# EasyEDA schematic NAKUJA REMIX.json
TITLE: Sheet_1; REV: 1.0; Date: 2022-04-21; Sheet: 1/1; Company: Your Company
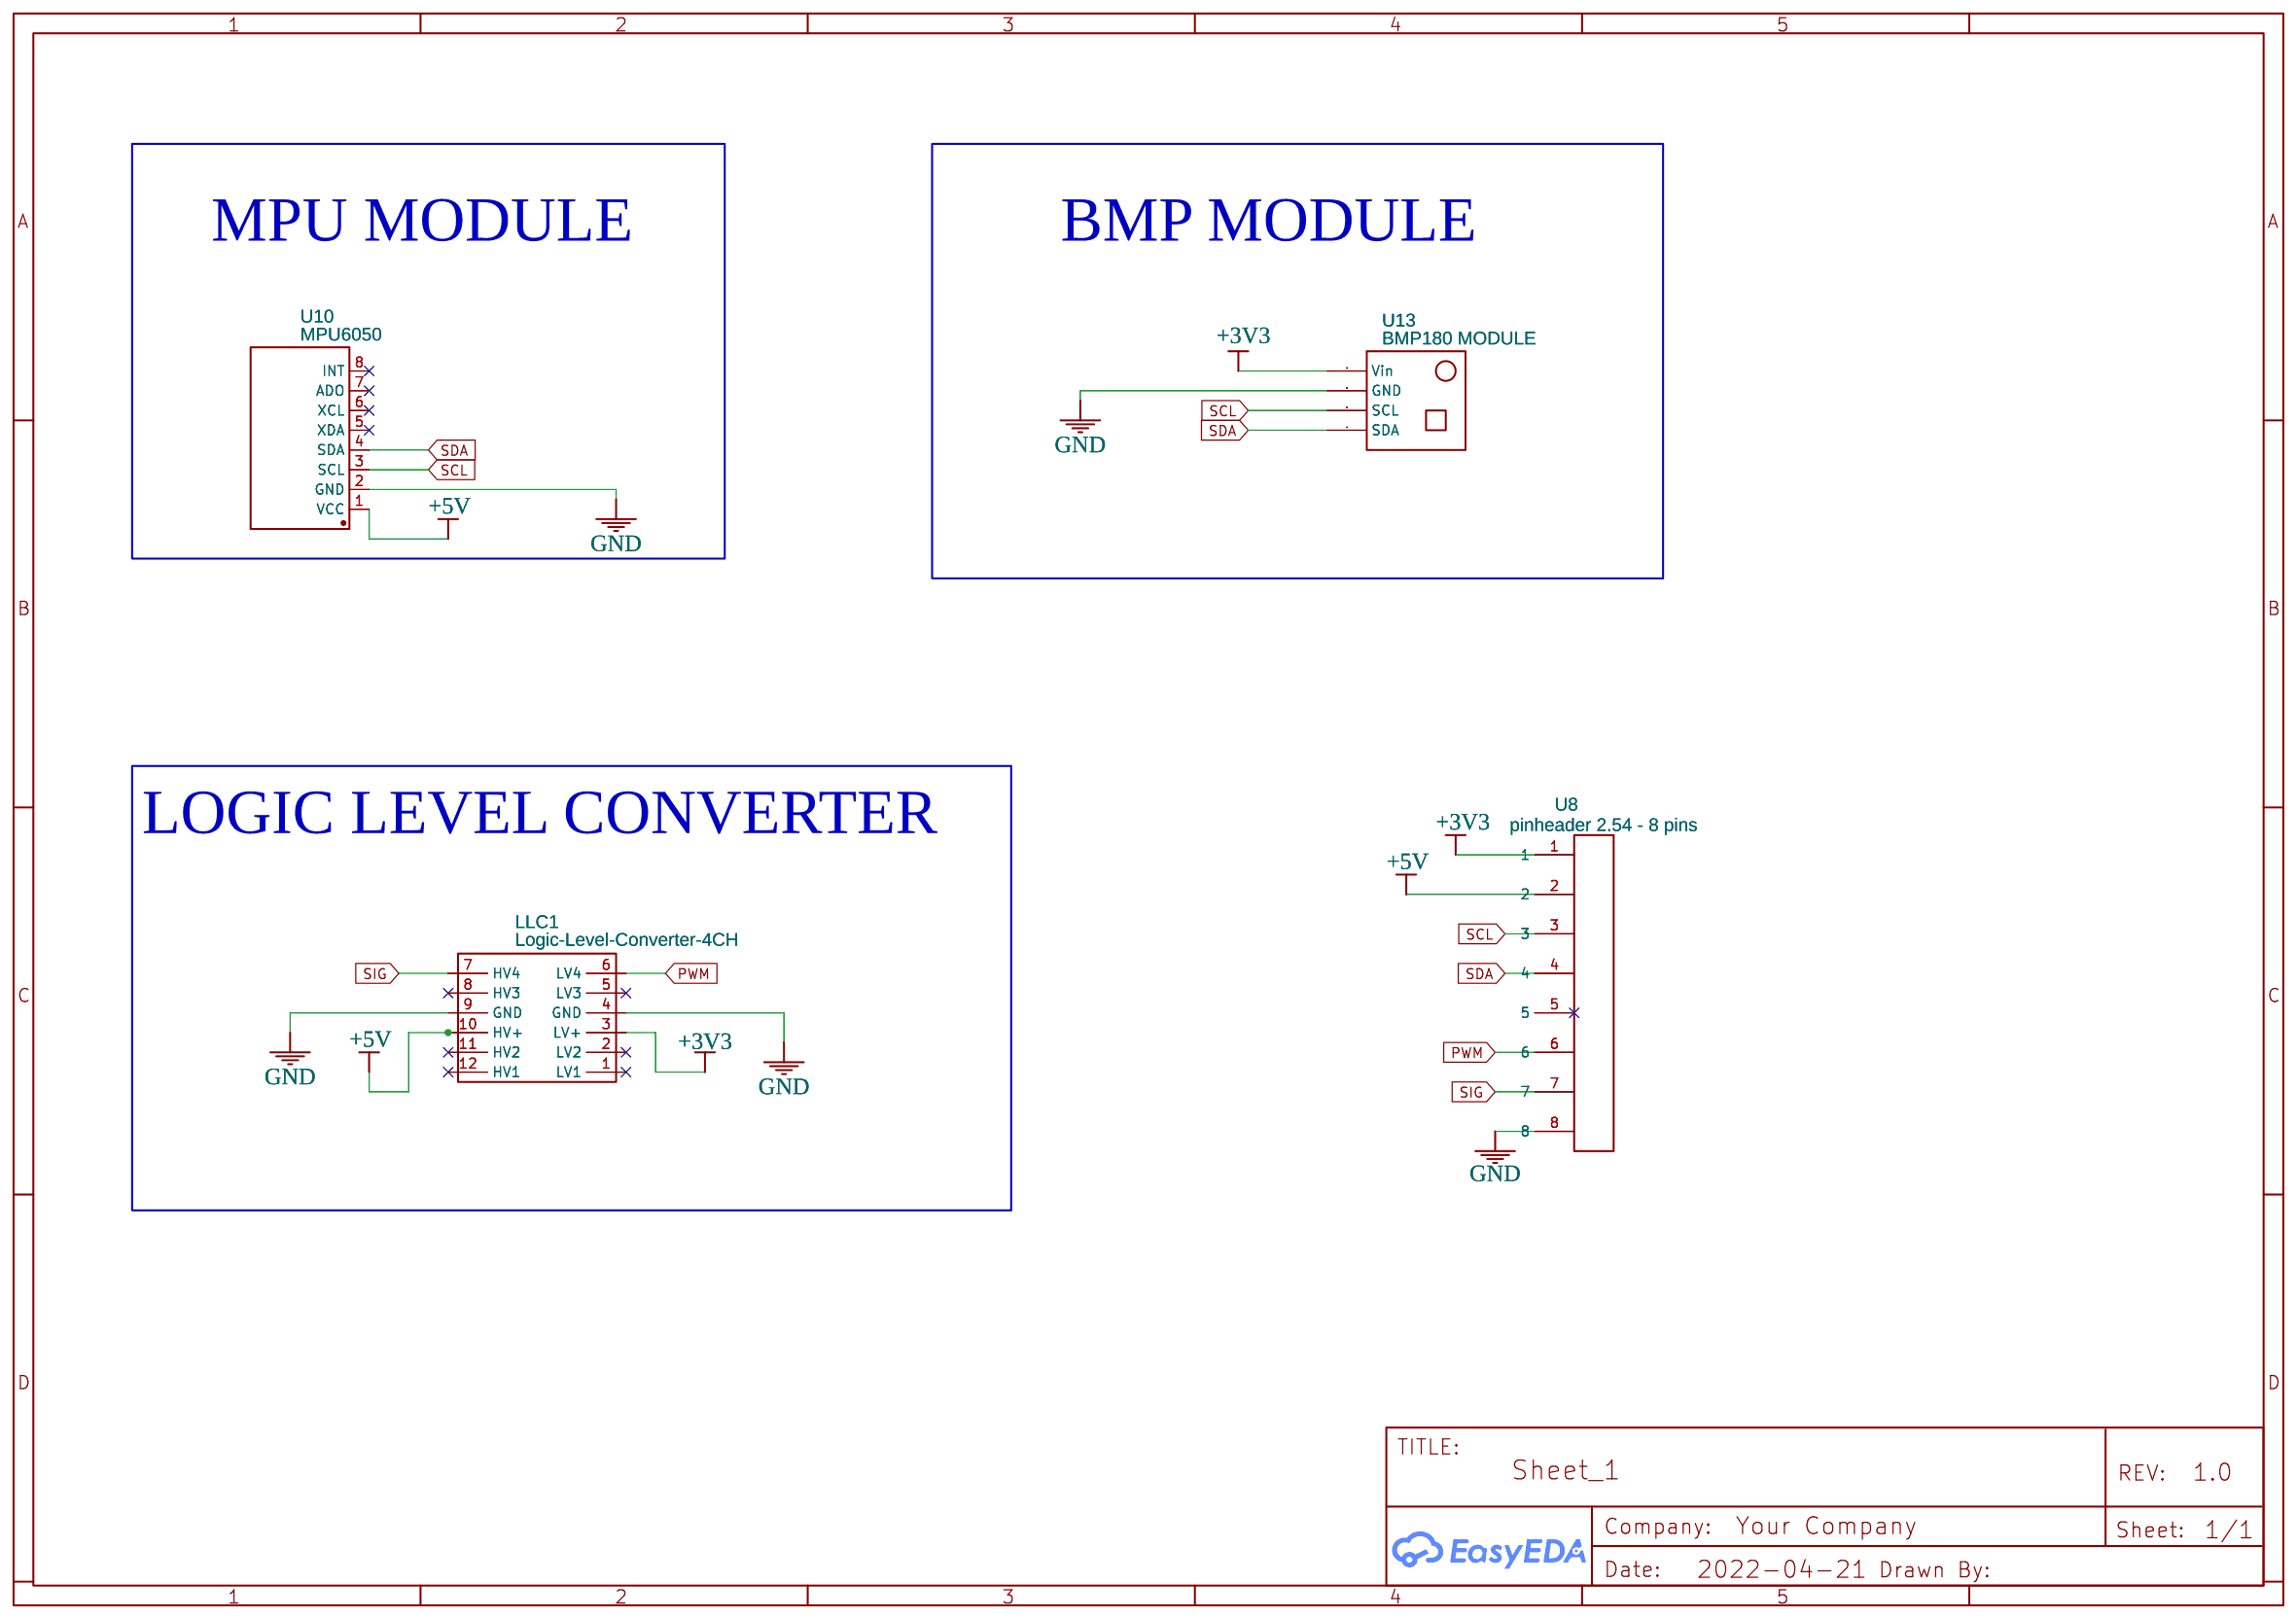
[diagram p0: schematic sheet]

## Parts
LLC1  Logic-Level-Converter-4CH  [LOGIC-LEVEL-CONVERTER-4CH]
U8  pinheader 2.54 - 8 pins  [PINHEADER 2.54 - 8 PINS]
U10  MPU6050  [MPU6050]
U13  BMP180 MODULE  [BMP180 MODULE (HW-596)]

## Library data of the parts
LLC1 = Logic-Level-Converter-4CH: Supplier Part: 50807; Supplier: Космодром; Contributor: Олег Мошник
U8 = pinheader 2.54 - 8 pins: Contributor: pramodsreelakam
U10 = MPU6050: Supplier Part: GY521; Contributor: rahulaggarwal
U13 = BMP180 MODULE: Manufacturer Part: BMP180 (HW-596); Contributor: esguti

## Nets
+3V3: LLC1.3(LV+) U8.1 U13.1(Vin)
+5V: LLC1.10(HV+) U8.2 U10.1(VCC)
GND: LLC1.4(GND) LLC1.9(GND) U8.8 U10.2(GND) U13.2(GND)
PWM: LLC1.6(LV4) U8.6
SCL: U8.3 U10.3(SCL) U13.3(SCL)
SDA: U8.4 U10.4(SDA) U13.4(SDA)
SIG: LLC1.7(HV4) U8.7

Not connected (* = marked no-connect by the designer): LLC1 1(LV1)* 2(LV2)* 5(LV3)* 8(HV3)* 11(HV2)* 12(HV1)*; U8 5*; U10 5(XDA)* 6(XCL)* 7(ADO)* 8(INT)*

## Notes on the sheet
- MPU MODULE
- BMP MODULE
- LOGIC LEVEL CONVERTER
